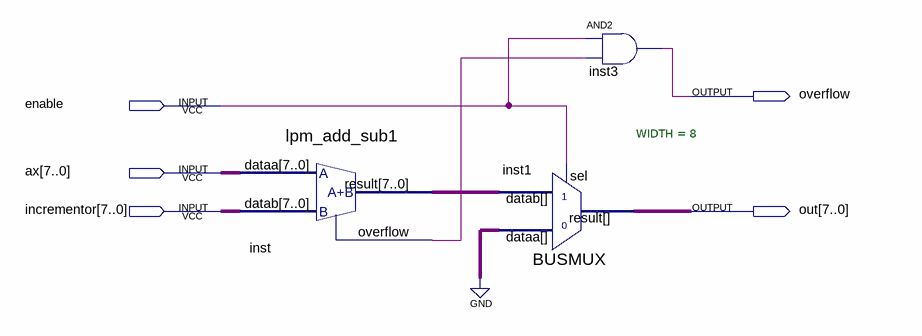
[diagram p0: schematic sheet]
// Quartus schematic XXX.bdf as structural Verilog: 3 symbols, 5 pins
module XXX (
  input  enable,
  input  [7:0] ax,
  input  [7:0] incrementor,
  output overflow,
  output [7:0] out
);

  wire inst_overflow;
  wire [7:0] inst_result;

  lpm_add_sub1 inst (.dataa(ax), .datab(incrementor), .result(inst_result), .overflow(inst_overflow));
  BUSMUX #(.WIDTH(8)) inst1 (.datab(inst_result), .sel(enable), .dataa({8{1'b0}}), .result(out));
  and inst3 (overflow, enable, inst_overflow);
endmodule
